# Altium project BMS_3S_16.4V.PrjPcb
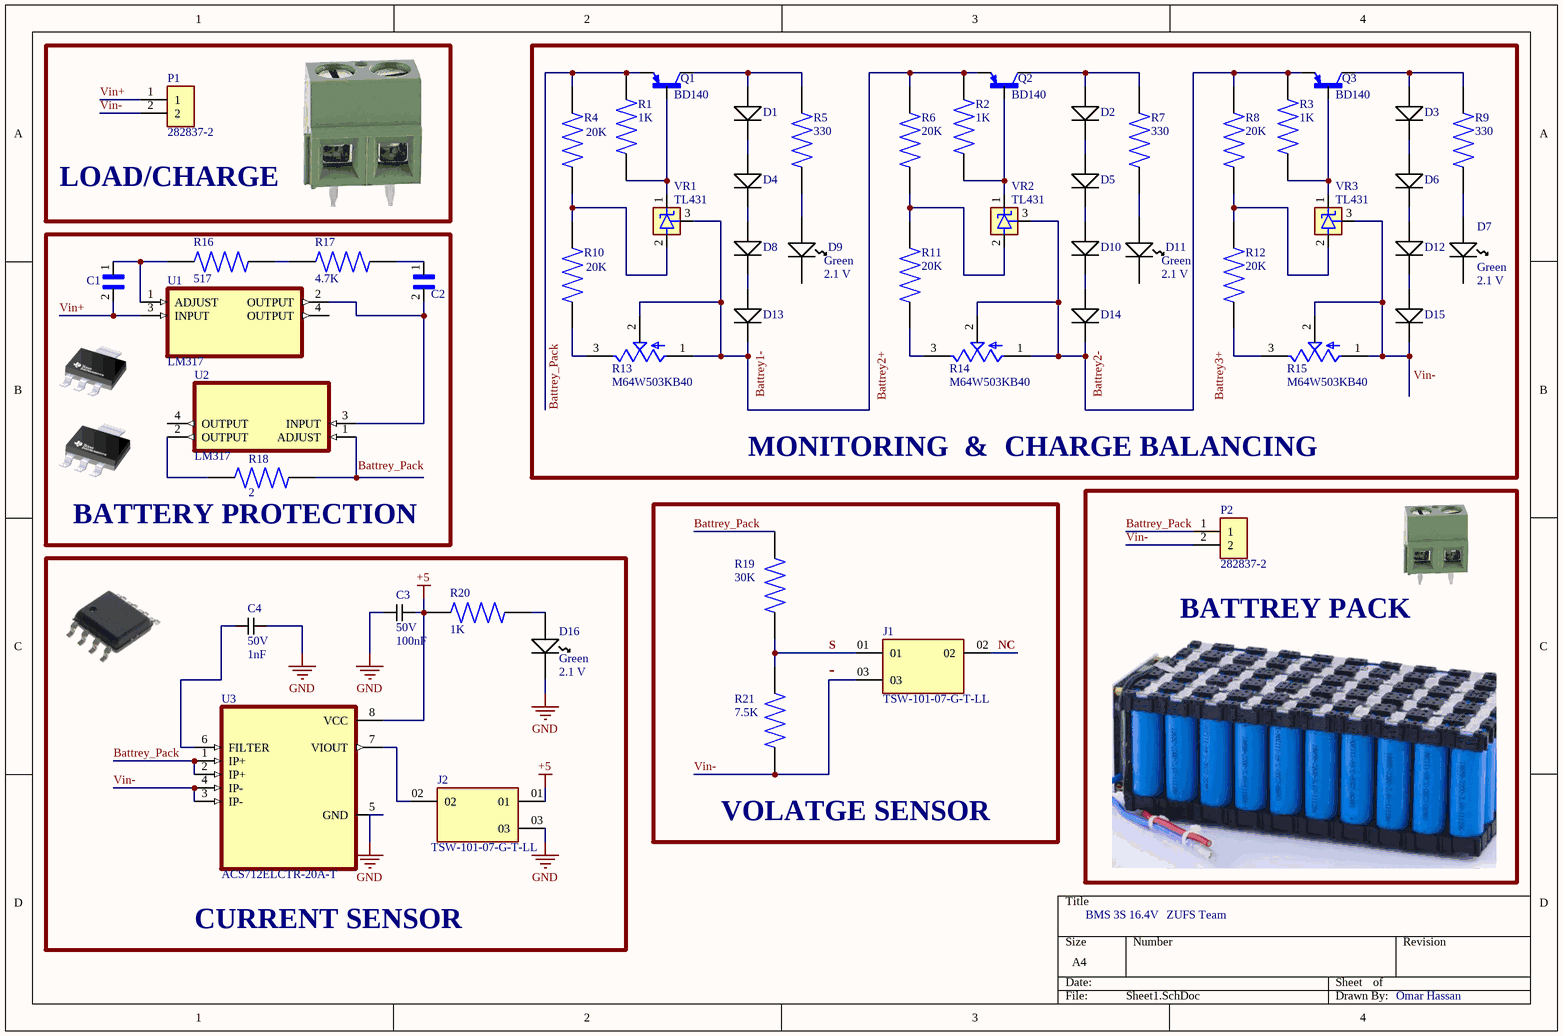
[diagram p0: Sheet1.SchDoc]
desginer: Omar Hassan; title: BMS 3S 16.4V
1 sheet, 54 parts. Net scope: global (net labels, ports and power ports of the same name join across sheets).
Board file: PCB1.PcbDoc

## Sheet Sheet1.SchDoc: BMS 3S 16.4V
size A4; SheetNumber: 1; SheetTotal: 1

### Parts
C1  GRM32ER61A107ME20K  [CAPC3225X270N]  (value not drawn)
C2  GRM32ER61A107ME20K  [CAPC3225X270N]  (value not drawn)
C3  Voltage: 50V  Capacitance: 100nF  [CAPCP2012X09N]  (hidden comment: 100nF Ceramic Multilayer Capacitor_1)
C4  Voltage: 50V  Capacitance: 1nF  [CAPCP2012X09N]  (hidden comment: 100nF Ceramic Multilayer Capacitor_1)
D1  Panasonic DB2J20900L Schottky Diode, 0.5A, 20V, 2.4ns, 2-Pin SMini2 F5 B  [DIOM1712X07N]  (value not drawn)
D2  Panasonic DB2J20900L Schottky Diode, 0.5A, 20V, 2.4ns, 2-Pin SMini2 F5 B  [DIOM1712X07N]  (value not drawn)
D3  Panasonic DB2J20900L Schottky Diode, 0.5A, 20V, 2.4ns, 2-Pin SMini2 F5 B  [DIOM1712X07N]  (value not drawn)
D4  Panasonic DB2J20900L Schottky Diode, 0.5A, 20V, 2.4ns, 2-Pin SMini2 F5 B  [DIOM1712X07N]  (value not drawn)
D5  Panasonic DB2J20900L Schottky Diode, 0.5A, 20V, 2.4ns, 2-Pin SMini2 F5 B  [DIOM1712X07N]  (value not drawn)
D6  Panasonic DB2J20900L Schottky Diode, 0.5A, 20V, 2.4ns, 2-Pin SMini2 F5 B  [DIOM1712X07N]  (value not drawn)
D7  Color: Green  Forward Voltage: 2.1 V  [LED1913X12NGREEN]  (hidden comment: Kingbright Green LED, 70 mcd 120 ° 0805)
D8  Panasonic DB2J20900L Schottky Diode, 0.5A, 20V, 2.4ns, 2-Pin SMini2 F5 B  [DIOM1712X07N]  (value not drawn)
D9  Color: Green  Forward Voltage: 2.1 V  [LED1913X12NGREEN]  (hidden comment: Kingbright Green LED, 70 mcd 120 ° 0805)
D10  Panasonic DB2J20900L Schottky Diode, 0.5A, 20V, 2.4ns, 2-Pin SMini2 F5 B  [DIOM1712X07N]  (value not drawn)
D11  Color: Green  Forward Voltage: 2.1 V  [LED1913X12NGREEN]  (hidden comment: Kingbright Green LED, 70 mcd 120 ° 0805)
D12  Panasonic DB2J20900L Schottky Diode, 0.5A, 20V, 2.4ns, 2-Pin SMini2 F5 B  [DIOM1712X07N]  (value not drawn)
D13  Panasonic DB2J20900L Schottky Diode, 0.5A, 20V, 2.4ns, 2-Pin SMini2 F5 B  [DIOM1712X07N]  (value not drawn)
D14  Panasonic DB2J20900L Schottky Diode, 0.5A, 20V, 2.4ns, 2-Pin SMini2 F5 B  [DIOM1712X07N]  (value not drawn)
D15  Panasonic DB2J20900L Schottky Diode, 0.5A, 20V, 2.4ns, 2-Pin SMini2 F5 B  [DIOM1712X07N]  (value not drawn)
D16  Color: Green  Forward Voltage: 2.1 V  [LED1913X12NGREEN]  (hidden comment: Kingbright Green LED, 70 mcd 120 ° 0805)
J1  TSW-101-07-G-T-LL  [SAMTEC_TSW-101-07-G-T-LL]
J2  TSW-101-07-G-T-LL  [SAMTEC_TSW-101-07-G-T-LL]
P1  282837-2  [TE_282837-2]
P2  282837-2  [TE_282837-2]
Q1  BD140  [TO229P760X270X1364-3]
Q2  BD140  [TO229P760X270X1364-3]
Q3  BD140  [TO229P760X270X1364-3]
R1  value 1K  [RESC3115X65N]  (hidden comment: CRGP1206F1K5)
R2  value 1K  [RESC3115X65N]  (hidden comment: CRGP1206F1K5)
R3  value 1K  [RESC3115X65N]  (hidden comment: CRGP1206F1K5)
R4  value 20K  [RESC3115X65N]  (hidden comment: CRGP1206F1K5)
R5  value 330  [RESC3115X65N]  (hidden comment: CRGP1206F1K5)
R6  value 20K  [RESC3115X65N]  (hidden comment: CRGP1206F1K5)
R7  value 330  [RESC3115X65N]  (hidden comment: CRGP1206F1K5)
R8  value 20K  [RESC3115X65N]  (hidden comment: CRGP1206F1K5)
R9  value 330  [RESC3115X65N]  (hidden comment: CRGP1206F1K5)
R10  value 20K  [RESC3115X65N]  (hidden comment: CRGP1206F1K5)
R11  value 20K  [RESC3115X65N]  (hidden comment: CRGP1206F1K5)
R12  value 20K  [RESC3115X65N]  (hidden comment: CRGP1206F1K5)
R13  M64W503KB40  [SIP460W50P254L970H980Q3P]
R14  M64W503KB40  [SIP460W50P254L970H980Q3P]
R15  M64W503KB40  [SIP460W50P254L970H980Q3P]
R16  value 517  [RESC3115X65N]  (hidden comment: CRGP1206F1K5)
R17  value 4.7K  [RESC3115X65N]  (hidden comment: CRGP1206F1K5)
R18  value 2  [RESC3115X65N]  (hidden comment: CRGP1206F1K5)
R19  value 30K  [RESC3115X65N]  (hidden comment: CRGP1206F1K5)
R20  value 1K  [RESC3115X65N]  (hidden comment: CRGP1206F1K5)
R21  value 7.5K  [RESC3115X65N]  (hidden comment: CRGP1206F1K5)
U1  LM317  [SOT230P700X180-4N]
U2  LM317  [SOT230P700X180-4N]
U3  ACS712ELCTR-20A-T  [SOIC127P600X175-8N]
VR1  TL431  [VREG_TL431CLP]
VR2  TL431  [VREG_TL431CLP]
VR3  TL431  [VREG_TL431CLP]

### Blocks framed on the sheet
LOAD/CHARGE: P1
BATTERY PROTECTION: C1 C2 R16-R18 U1 U2
VOLATGE SENSOR: J1 R19 R21
BATTREY PACK: P2
CURRENT SENSOR: C3 C4 D16 J2 R20 U3

### Nets
+5: C3.2 J2.01 R20.2 U3.8(VCC)
GND: C3.1 C4.2 D16.2(K) J2.03 U3.5(GND)
-: J1.03 P1.2 P2.2 R21.1 U3.3(IP-) U3.4(IP-)  [also labelled Vin-]
Battrey_Pack: P2.1 Q1.1(E) R1.2 R4.2 R19.2 U3.1(IP+) U3.2(IP+)
NC: J1.02
S: J1.01 R19.1 R21.2
Vin+: C1.2 P1.1 U1.3(INPUT)
NetC1_1: C1.1 R16.2 U1.1(ADJUST)
NetC2_1: C2.1 R17.1
NetC2_2: C2.2 U1.2(OUTPUT) U2.3(INPUT)
NetC4_1: C4.1 U3.6(FILTER)
NetD1_1: D1.1 D4.2
NetD1_2: D1.2 Q1.2(C) R5.2
NetD2_1: D2.1 D5.2
NetD2_2: D2.2 Q2.2(C) R7.2
NetD3_1: D3.1 D6.2
NetD3_2: D3.2 Q3.2(C) R9.2
NetD4_1: D4.1 D8.2
NetD5_1: D5.1 D10.2
NetD6_1: D6.1 D12.2
NetD7_1: D7.1(A) R9.1
NetD8_1: D8.1 D13.2
NetD9_1: D9.1(A) R5.1
NetD10_1: D10.1 D14.2
NetD11_1: D11.1(A) R7.1
NetD12_1: D12.1 D15.2
NetD13_1: D13.1 Q2.1(E) R2.2 R6.2 R13.1(A) R13.2(B) VR1.3(REF)
NetD14_1: D14.1 Q3.1(E) R3.2 R8.2 R14.1(A) R14.2(B) VR2.3(REF)
NetD15_1: D15.1 R15.1(A) R15.2(B) VR3.3(REF)
NetD16_1: D16.1(A) R20.1
NetJ2_02: J2.02 U3.7(VIOUT)
NetQ1_3: Q1.3(B) R1.1 VR1.1(CATHODE)
NetQ2_3: Q2.3(B) R2.1 VR2.1(CATHODE)
NetQ3_3: Q3.3(B) R3.1 VR3.1(CATHODE)
NetR4_1: R4.1 R10.2 VR1.2(ANODE)
NetR6_1: R6.1 R11.2 VR2.2(ANODE)
NetR8_1: R8.1 R12.2 VR3.2(ANODE)
NetR10_1: R10.1 R13.3(C)
NetR11_1: R11.1 R14.3(C)
NetR12_1: R12.1 R15.3(C)
NetR16_1: R16.1 R17.2
NetR18_1: R18.1 U2.1(ADJUST)
NetR18_2: R18.2 U2.2(OUTPUT)

Not connected (* = marked no-connect by the designer): D7 2(K); D9 2(K); D11 2(K); U1 4(OUTPUT); U2 4(OUTPUT)

### Notes on the sheet
- MONITORING
- &
- CHARGE BALANCING
- ZUFS Team
- Labels drawn without touching a wire or pin: Battrey1-, Battrey2+, Battrey2-, Battrey3+, Battrey_Pack, Vin-

### Library data of the parts
C1 C2 = GRM32ER61A107ME20K: 100 ÂµF Â±20% 10V Ceramic Capacitor X5R 1210 (3225 Metric); MF: Murata Electronics; Digi-Key_Part_Number: 490-14681-2-ND; Check_prices: https://www.snapeda.com/parts/GRM32ER61A107ME20K/Murata+Electronics+North+America/view-part/?ref=eda; Value: *; Purchase-URL: https://pricing.snapeda.com/search/part/GRM32ER61A107ME20K/?ref=eda; SnapEDA_Link: https://www.snapeda.com/parts/GRM32ER61A107ME20K/Murata+Electronics+North+America/view-part/?ref=snap; MP: GRM32ER61A107ME20K; Package: 3225 Murata
C3 C4 = 100nF Ceramic Multilayer Capacitor_1: AVX 0805 Standard 100nF Ceramic Multilayer Capacitor, 50 V dc X7R Dielectric ±10% SMD; Creator: Ritesh Kanjee; Date Created: 18 February 2015; Package: 0805; Manufacturer: AVX; RS Stock No.: 464-6688; Datasheet URL: http://za.rs-online.com/web/p/ceramic-multilayer-capacitors/4646688/
D1-D6 D8 D10 D12-D15 = Schottky Diode, 0.5A, 20V, 2.4ns, 2-Pin SMini2 F5 B: Created By: R Kanjee; Date Created: 1 March 2015; Manufacturer: Panasonic; RS Stock No.: 713-2703; Manufacturer Part No.: DB2J20900L; Datasheet: http://docs-europe.electrocomponents.com/webdocs/1398/0900766b813986b3.pdf; Maximum Continuous Forward Current: 0.5A; Peak Reverse Repetitive Voltage: 20V
D7 D9 D11 D16 = Kingbright Green LED, 70 mcd 120 ° 0805: Manufacturer Part No.: KP-2012MGC; Creator: Ritesh Kanjee; Date Created: 18 February 2015; Manufacturer: KingBright; RS Stock No.: 466-3778; Datasheet URL: http://za.rs-online.com/web/p/visible-leds/4663778/
P1 P2 = 282837-2: Ð Ð°Ð·ÑŠÐµÐ¼Ð½Ñ‹Ðµ ÐºÐ»ÐµÐ¼Ð¼Ð½Ñ‹Ðµ ÐºÐ¾Ð»Ð¾Ð´ÐºÐ¸ Ð Ð¾Ð·ÐµÑ‚ÐºÐ° 2 Ð¿Ð¾Ð»Ð¾Ð¶ÐµÐ½Ð¸Ñ 5,08 Ð¼Ð¼ ÐŸÑ€Ð¸Ð¿Ð¾Ð¹ Ð¿Ñ€ÑÐ¼Ð¾Ð¹ Ñ‡ÐµÑ€ÐµÐ· Ð¾Ñ‚Ð²ÐµÑ€ÑÑ‚Ð¸Ðµ 13,5 Ð / ÐºÐ¾Ð½Ñ‚Ð°ÐºÑ‚; MF: TE Connectivity; SnapEDA_Link: https://www.snapeda.com/parts/282837-2/TE+Connectivity+AMP+Connectors/view-part/?ref=snap; Price: None; Check_prices: https://www.snapeda.com/parts/282837-2/TE+Connectivity+AMP+Connectors/view-part/?ref=eda; Purchase-URL: https://pricing.snapeda.com/search/part/282837-2/?ref=eda; MP: 282837-2; Value: *; Availability: In Stock; Package: None
Q1-Q3 = BD140: Bipolar (BJT) Transistor PNP 80 V 1.5 A - 1.25 W Through Hole TO-126-3; MF: ON Semiconductor; SnapEDA_Link: https://www.snapeda.com/parts/BD140/Onsemi/view-part/?ref=snap; Package: TO-225-3 ON Semiconductor; Value: *; MP: BD140; Check_prices: https://www.snapeda.com/parts/BD140/Onsemi/view-part/?ref=eda
R1-R12 R16-R21 = CRGP1206F1K5: Fixed Resistor CRGP 1206 1K5 1%; MF: TE Connectivity; MP: CRGP1206F1K5; DigiKey-Purchase-URL: https://snapeda.com/shop?store=DigiKey&id=3187122; SnapEDA_Link: https://www.snapeda.com/parts/CRGP1206F1K5/TE%20Connectivity/view-part/3187122/?ref=snap; Mouser-Purchase-URL: https://snapeda.com/shop?store=Mouser&id=3187122; Digi-Key_Part_Number: A130540CT-ND; Package: 3115 TE Connectivity; BuyPart: https://www.snapeda.com/parts/CRGP1206F1K5/TE%20Connectivity/view-part/3187122/?ref=eda
R13-R15 = M64W503KB40: 50 kOhms 0.5W, 1/2W PC Pins Through Hole Trimmer Potentiometer Cermet 21.0 Turn Top Adjustment; MF: Vishay; SnapEDA_Link: https://www.snapeda.com/parts/M64W503KB40/Vishay+Spectrol/view-part/?ref=snap; Package: TSOP-34836 Vishay; Value: *; MP: M64W503KB40; Check_prices: https://www.snapeda.com/parts/M64W503KB40/Vishay+Spectrol/view-part/?ref=eda
U1 U2 = LM317DCYG3: 1.5-A, 40-V, adjustable linear voltage regulator 4-SOT-223 0 to 125; MF: Texas Instruments; MP: LM317DCYG3; Value: *; Check_prices: https://www.snapeda.com/parts/LM317DCYG3/Texas+Instruments/view-part/?ref=eda; Package: SOT-223-4 Texas Instruments; Price: None; Availability: In Stock; SnapEDA_Link: https://www.snapeda.com/parts/LM317DCYG3/Texas+Instruments/view-part/?ref=snap; Purchase-URL: https://pricing.snapeda.com/search/part/LM317DCYG3/?ref=eda
U3 = ACS712ELCTR-20A-T: Current Sensor 20A 1 Channel Hall Effect, Open Loop Bidirectional 8-SOIC (0.154, 3.90mm Width); MF: Allegro; Value: *; Purchase-URL: https://pricing.snapeda.com/search/part/ACS712ELCTR-20A-T/?ref=eda; Package: SOIC-8 Allegro MicroSystems LLC; Availability: In Stock; Check_prices: https://www.snapeda.com/parts/ACS712ELCTR-20A-T/Allegro+Industries/view-part/?ref=eda; Price: None; SnapEDA_Link: https://www.snapeda.com/parts/ACS712ELCTR-20A-T/Allegro+Industries/view-part/?ref=snap; MP: ACS712ELCTR-20A-T
VR1-VR3 = TL431CLP: Adjustable precision shunt regulator; MF: Texas Instruments; SnapEDA_Link: https://www.snapeda.com/parts/TL431CLP/Texas+Instruments/view-part/?ref=snap; Package: TO-92 Texas Instruments; Value: *; MP: TL431CLP; Check_prices: https://www.snapeda.com/parts/TL431CLP/Texas+Instruments/view-part/?ref=eda
J1 J2 = TSW-101-07-G-T-LL: Package: None; Price: None; Value: *; MP: TSW-101-07-G-T-LL; Availability: Unavailable